# EasyEDA Pro project PWMFanController.epro

# Schematic Schematic1
Board Name: Board1; Create Date: 2026-01-06; Page Name: P1; Project Name: PWMFanController; Schematic Name: Schematic1; Update Date: 2026-07-08; Company: EasyEDA.com; Page Size: A4; Version: V1.0
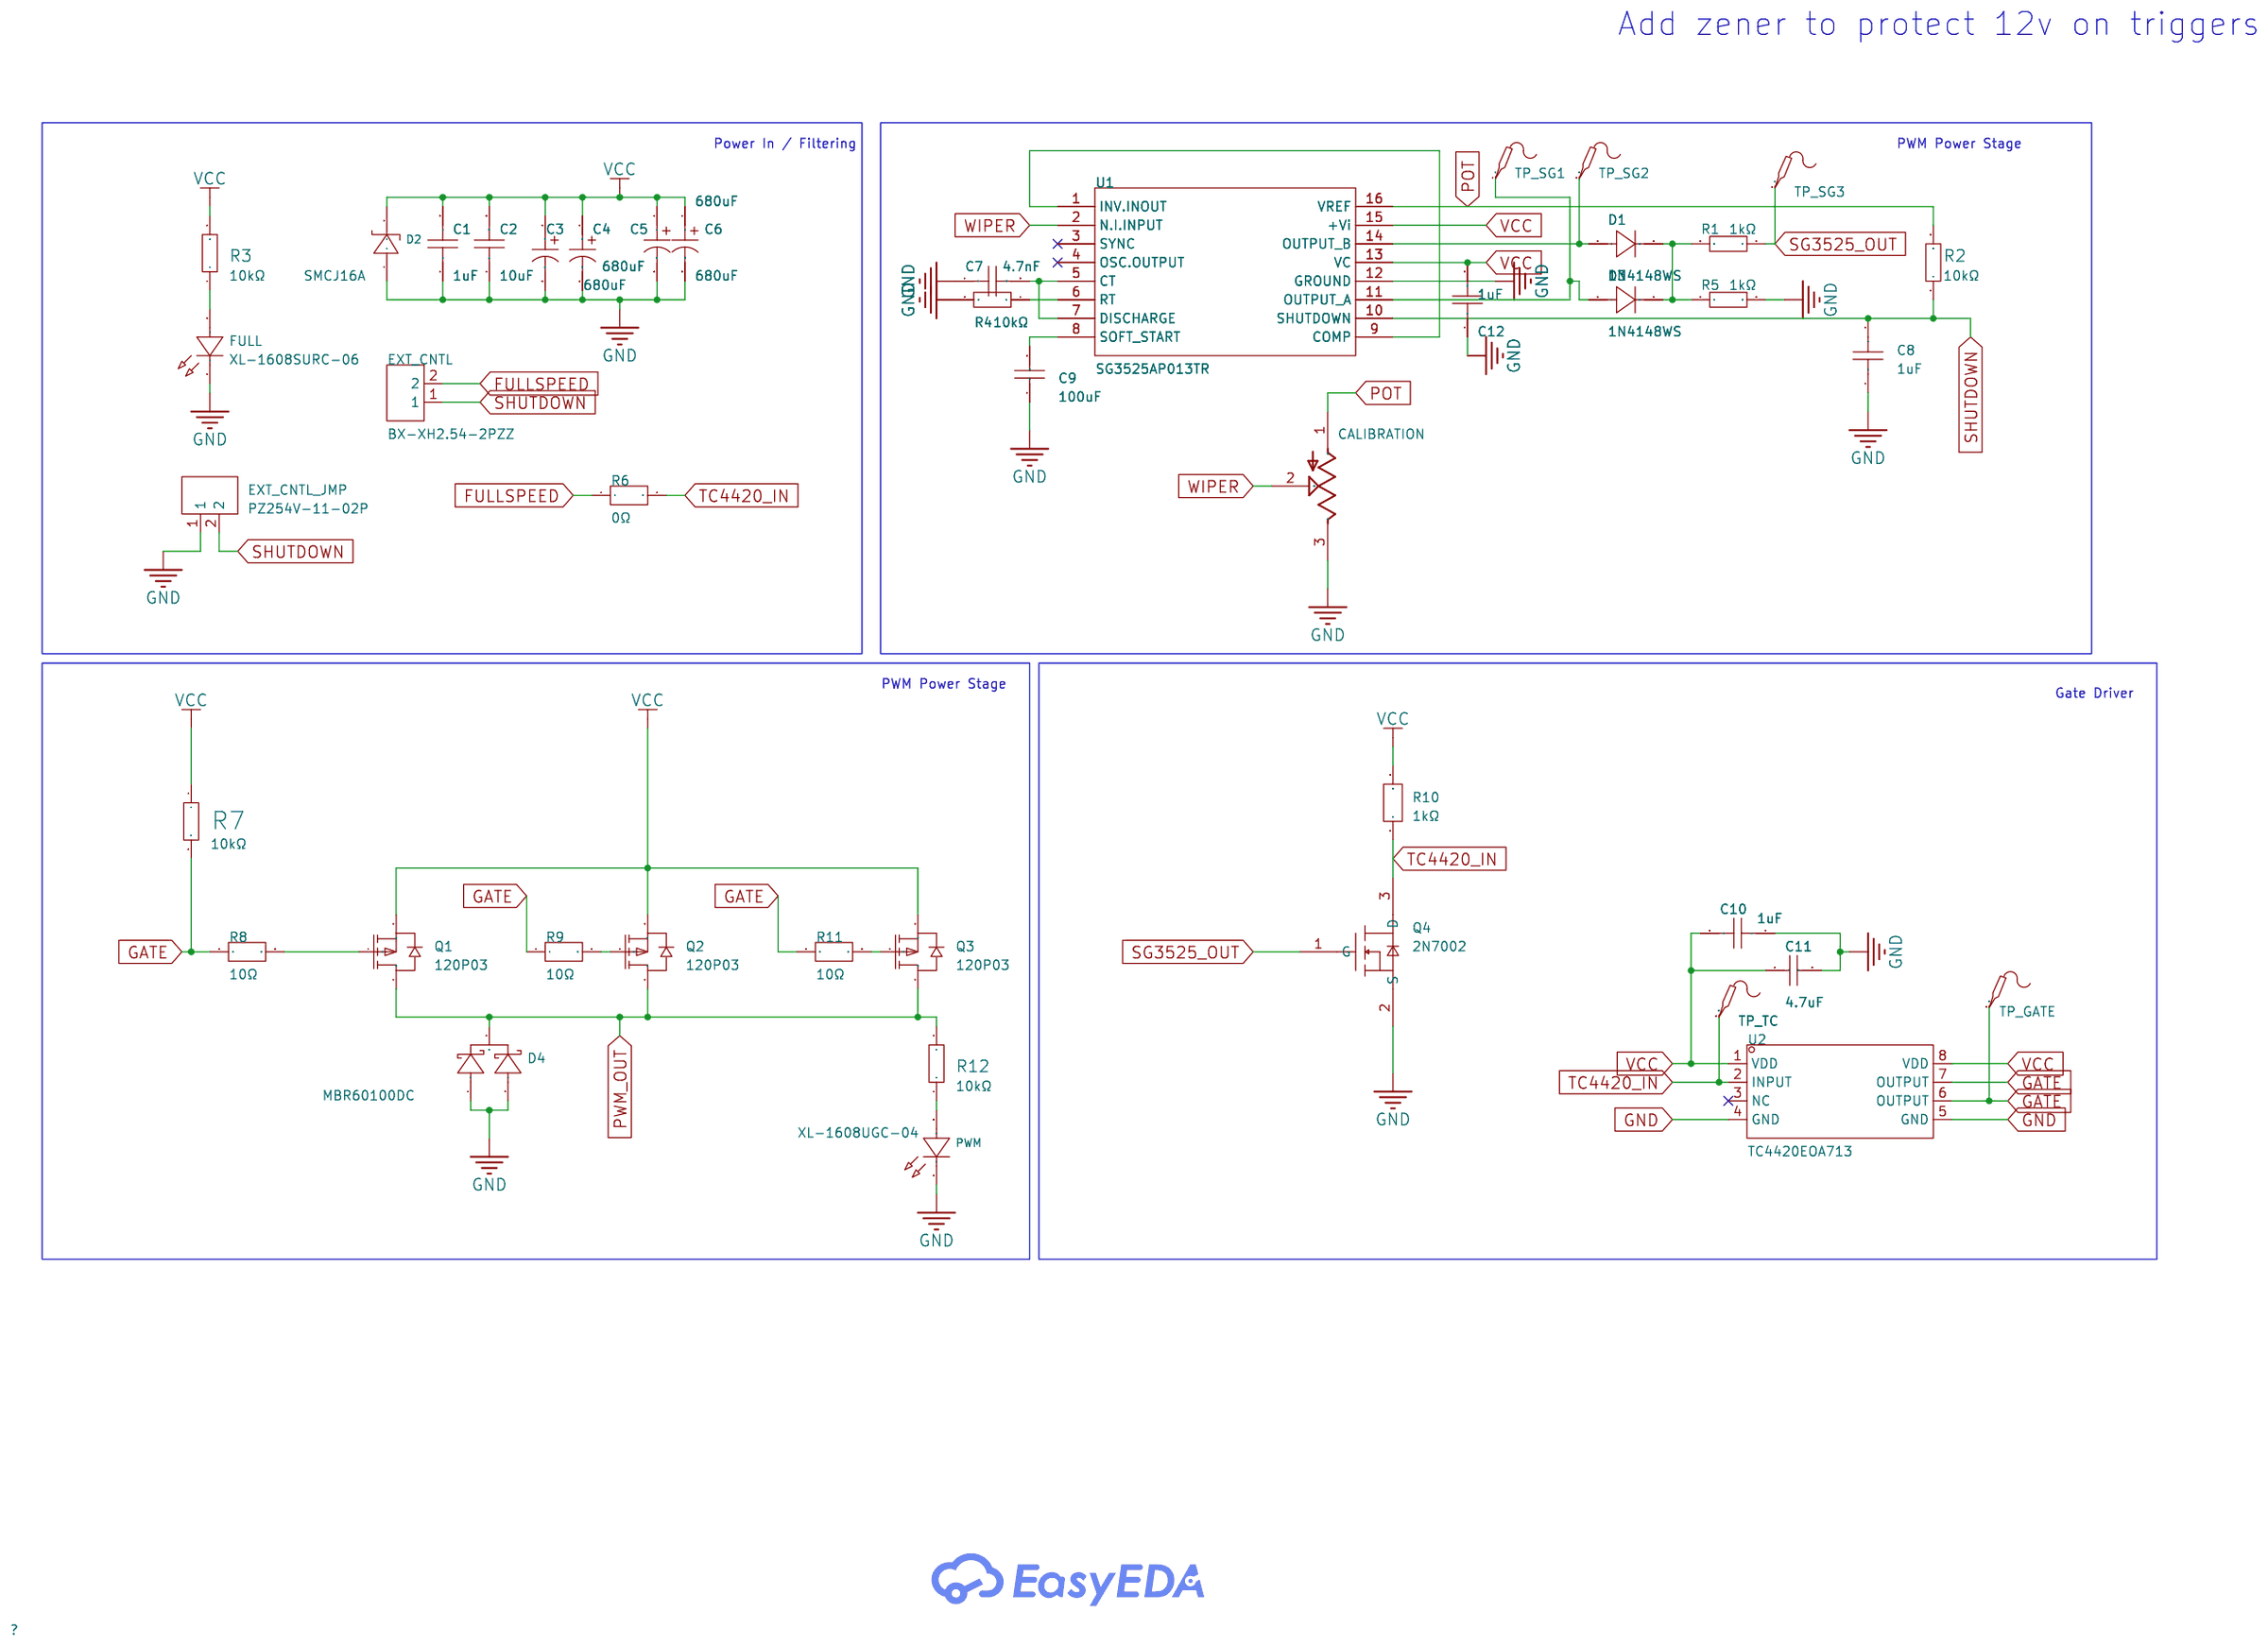
[diagram p0: schematic sheet]

## Parts
C1  1uF  [C0805]
C2  10uF  [C0805]
C3  680uF  [CAP-SMD_BD10.0-L10.3-W10.3-FD-LS11.0_H12.0]
C4  680uF  [CAP-SMD_BD10.0-L10.3-W10.3-FD-LS11.0_H12.0]
C5  680uF  [CAP-SMD_BD10.0-L10.3-W10.3-FD-LS11.0_H12.0]
C6  680uF  [CAP-SMD_BD10.0-L10.3-W10.3-FD-LS11.0_H12.0]
C7  4.7nF  [C0603]
C8  1uF  [C0603]
C9  100uF  [C1206]
C10  1uF  [C0603]
C11  4.7uF  [C0603]
C12  1uF  [C0603]
CALIBRATION  10kΩ  [RES-ADJ-TH_3362P]
D1  1N4148WS  [SOD-323_L1.8-W1.3-LS2.5-RD]
D2  SMCJ16A  [SMC_L7.1-W6.2-LS8.1-R-RD]
D3  1N4148WS  [SOD-323_L1.8-W1.3-LS2.5-RD]
D4  MBR60100DC  [TO-263-3_L10.2-W9.0-P5.08-LS15.2-BR]
EXT_CNTL  BX-XH2.54-2PZZ  [CONN-TH_2P-P2.50_BX-XH2.54-2PZZ]
EXT_CNTL_JMP  PZ254V-11-02P  [HDR-TH_2P-P2.54-V-M]
FULL  XL-1608SURC-06  [LED0603-RD_RED]
PWM  XL-1608UGC-04  [LED0603-RD_GREEN]
Q1  120P03  [TO-252-2_L6.6-W6.1-P4.57-LS9.9-BR-CW]
Q2  120P03  [TO-252-2_L6.6-W6.1-P4.57-LS9.9-BR-CW]
Q3  120P03  [TO-252-2_L6.6-W6.1-P4.57-LS9.9-BR-CW]
Q4  2N7002  [SOT-23-3_L2.9-W1.3-P1.90-LS2.4-BR]
R1  1kΩ  [R0603]
R2  10kΩ  [R0603]
R3  10kΩ  [R0603]
R4  10kΩ  [R0603]
R5  1kΩ  [R0603]
R6  0Ω  [R1210]
R7  10kΩ  [R0603]
R8  10Ω  [R0805]
R9  10Ω  [R0805]
R10  1kΩ  [R1210]
R11  10Ω  [R0805]
R12  10kΩ  [R0603]
TP_GATE  -  [Test-Point-0.5mm]
TP_SG1  -  [Test-Point-0.5mm]
TP_SG2  -  [Test-Point-0.5mm]
TP_SG3  -  [Test-Point-0.5mm]
TP_TC  -  [Test-Point-0.5mm]
U1  SG3525AP013TR  [SOIC-16_L9.9-W3.9-P1.27-LS6.0-BL]
U2  TC4420EOA713  [SOIC-8_L5.0-W4.0-P1.27-LS6.0-BL]

## Library data of the parts
C1 = GCM21BR7YA105KA55L: Capacitance: Tolerance:±10% Tolerance:±10% Voltage Rated: Temperature Coefficient:; LCSC Part Name: 1uF ±10% 35V; Supplier Part: C161268; Manufacturer: muRata(村田); Supplier Footprint: 0805; JLCPCB Part Class: Extended Part; Datasheet: https://atta.szlcsc.com/upload/public/pdf/source/20180821/C161268_D058CC9A7C4743C3F9DA2C30E4C6C8F3.pdf; Supplier: LCSC; Tolerance: ±10%
C2 = GRM21BC8YA106KE11L: Capacitance: Tolerance:±10% Tolerance:±10% Voltage Rated: Temperature Coefficient:; LCSC Part Name: 10uF ±10% 35V; Supplier Part: C469541; Manufacturer: muRata(村田); Supplier Footprint: 0805; JLCPCB Part Class: Extended Part; Datasheet: https://atta.szlcsc.com/upload/public/pdf/source/20191220/C469541_B6897061B33E942F3C678D5E9B5F39EC.pdf; Supplier: LCSC; Tolerance: ±10%
C3-C6 = MA35V680M10X13: Capacitance:680uF Tolerance:±20% Tolerance:±20% Voltage Rating:35V Ripple Current:3.9A@100kHz Equivalent Series Resistance(ESR):18mΩ@100kHz Type:Polymer Diameter:10mm Height - Seated (Max):13.5mm Lifetime:2000hrs@105℃ Operating Temperature:-55℃~+105℃ Oper; LCSC Part Name: 680uF ±20% 35V; Supplier Part: C48971043; Manufacturer: JIERR(捷而瑞); Supplier Footprint: SMD,D10xL13.5mm; JLCPCB Part Class: Extended Part; Datasheet: https://item.szlcsc.com/datasheet/MA35V680M10X13/51296248.html; Supplier: LCSC; Tolerance: ±20%; Voltage Rating: 35V; Ripple Current: 3.9A@100kHz; Equivalent Series Resistance(ESR): 18mΩ@100kHz; Type: Polymer; Diameter: 10mm; Height - Seated (Max): 13.5mm; Lifetime: 2000hrs@105℃; Operating Temperature: -55℃~+105℃
C7 = CC0603JRNPO9BN472: Capacitance: Tolerance:±5% Tolerance:±5% Voltage Rated: Temperature Coefficient:; LCSC Part Name: 4.7nF ±5% 50V; Supplier Part: C576818; Manufacturer: YAGEO(国巨); Supplier Footprint: 0603; JLCPCB Part Class: Extended Part; Datasheet: https://atta.szlcsc.com/upload/public/pdf/source/20200423/C519397_5D7358A8DEECBF1C07A68D711E115506.pdf; Supplier: LCSC; Tolerance: ±5%
C8 C12 = HGC0603R7105K250NTHJ: Capacitance:1uF Tolerance:±10% Tolerance:±10% Voltage Rating:25V Temperature Coefficient:X7R; LCSC Part Name: 1uF ±10% 25V; Supplier Part: C33546005; Manufacturer: Chinocera(华瓷); Supplier Footprint: 0603; JLCPCB Part Class: Extended Part; Datasheet: https://item.szlcsc.com/datasheet/HGC0603R7105K250NTHJ/35278483.html; Supplier: LCSC; Tolerance: ±10%; Voltage Rating: 25V; Temperature Coefficient: X7R
C9 = CL31A107MQHNNNE: Capacitance:100uF Tolerance:±20% Tolerance:±20% Voltage Rating:6.3V Temperature Coefficient:X5R; LCSC Part Name: 100uF ±20% 6.3V; Supplier Part: C15008; Manufacturer: SAMSUNG(三星); Supplier Footprint: 1206; JLCPCB Part Class: Basic Part; Datasheet: https://item.szlcsc.com/datasheet/CL31A107MQHNNNE/15681.html; Supplier: LCSC; Tolerance: ±20%; Voltage Rating: 6.3V; Temperature Coefficient: X5R
C10 = CGA3E1X7R1V105KT000N: Capacitance:1uF Tolerance:±10% Tolerance:±10% Voltage Rating:35V Temperature Coefficient:X7R; LCSC Part Name: 1uF ±10% 35V; Supplier Part: C342956; Manufacturer: TDK; Supplier Footprint: 0603; JLCPCB Part Class: Extended Part; Datasheet: https://item.szlcsc.com/datasheet/CGA3E1X7R1V105KT000N/319806.html; Supplier: LCSC; Tolerance: ±10%; Voltage Rating: 35V; Temperature Coefficient: X7R
C11 = EMK107ABJ475KA-T: Capacitance:4.7uF Tolerance:±10% Tolerance:±10% Voltage Rating:16V Temperature Coefficient:X5R; LCSC Part Name: MSASE168AB5475KTNA01 4.7uF ±10% 16V; Supplier Part: C92758; Manufacturer: TAIYO YUDEN(太诱); Supplier Footprint: 0603; JLCPCB Part Class: Extended Part; Datasheet: https://item.szlcsc.com/datasheet/EMK107ABJ475KA-T/93952.html; Supplier: LCSC; Tolerance: ±10%; Voltage Rating: 16V; Temperature Coefficient: X5R
CALIBRATION = 3362P-1-103_C118956: Resistance: Tolerance:±10% Tolerance:±10%; LCSC Part Name: 10kΩ ±10%; Supplier Part: C118956; Manufacturer: BOCHEN(博晨); Manufacturer Part: 3362P-1-103; Supplier Footprint: 插件; JLCPCB Part Class: Extended Part; Datasheet: https://atta.szlcsc.com/upload/public/pdf/source/20171114/C118956_15106326650691117445.pdf; Supplier: LCSC; Tolerance: ±10%; Check: true
D1 D3 = 1N4148WS_C917117: Diode Configuration:Independent Voltage - Forward(Vf@If):1.25V@150mA Voltage - DC Reverse(Vr):75V Current - Rectified:200mA Pd - Power Dissipation:200mW Reverse Leakage Current (Ir):1uA@75V Reverse Recovery Time (trr):4ns Operating Junction Temperature Ra; LCSC Part Name: 75V 200mA; Supplier Part: C917117; Manufacturer: JSMSEMI(杰盛微); Supplier Footprint: SOD-323; JLCPCB Part Class: Extended Part; Datasheet: https://item.szlcsc.com/datasheet/1N4148WS/991613.html; Supplier: LCSC; Diode Configuration: Independent; Voltage - Forward(Vf@If): 1.25V@150mA; Voltage - DC Reverse(Vr): 75V; Current - Rectified: 200mA; Pd - Power Dissipation: 200mW; Reverse Leakage Current (Ir): 1uA@75V; Reverse Recovery Time (trr): 4ns; Operating Junction Temperature Range: -55℃~+150℃@(Tj); Non-Repetitive Peak Forward Surge Current: 2A
D2 = SMCJ16A_C10249: Reverse Stand-Off Voltage (Vrwm):16V Clamping Voltage:26V Peak Pulse Current (Ipp):57.7A Voltage - Breakdown:17.8V Type:TVS; Supplier Part: C10249; Manufacturer: RUILON(瑞隆源); Supplier Footprint: SMC(DO-214AB); JLCPCB Part Class: Extended Part; Datasheet: https://item.szlcsc.com/datasheet/SMCJ16A/10791.html; Supplier: LCSC; Reverse Stand-Off Voltage (Vrwm): 16V; Clamping Voltage: 26V; Peak Pulse Current (Ipp): 57.7A; Voltage - Breakdown: 17.8V; Type: TVS
D4 = MBR60100DC: Voltage - Forward(Vf@If):840mV@30A Voltage - DC Reverse(Vr):100V Current - Rectified:60A Reverse Leakage Current (Ir):3mA@100V Non-Repetitive Peak Forward Surge Current:450A; LCSC Part Name: 电压:100V 电流:60A; Supplier Part: C6069541; Manufacturer: YFW(佑风微); Supplier Footprint: TO-263; JLCPCB Part Class: Extended Part; Datasheet: https://item.szlcsc.com/datasheet/MBR60100DC/7009147.html; Supplier: LCSC; Voltage - Forward(Vf@If): 840mV@30A; Voltage - DC Reverse(Vr): 100V; Current - Rectified: 60A; Reverse Leakage Current (Ir): 3mA@100V; Non-Repetitive Peak Forward Surge Current: 450A
EXT_CNTL = BX-XH2.54-2PZZ: Pins Structure:1x2P Pitch:2.5mm Mounting Type:Through Hole Reference Series:XH Number of Pins:2P Number of Rows:1 Number of PINs Per Row:2 Row Spacing:- Current Rating:3A Contact Material:Brass Contact Plating:Tin Operating Temperature:-25℃~+85℃ Operating; LCSC Part Name: 1x2P 间距:2.5mm 直插 系列:XH; Supplier Part: C18077833; Manufacturer: Bossie(博锡); Supplier Footprint: 插件,P=2.54mm; JLCPCB Part Class: Extended Part; Datasheet: https://item.szlcsc.com/datasheet/BX-XH2.54-2PZZ/19218234.html; Supplier: LCSC; Pins Structure: 1x2P; Pitch: 2.5mm; Mounting Type: Through Hole; Reference Series: XH; Number of Pins: 2P; Number of Rows: 1; Number of PINs Per Row: 2; Current Rating: 3A; Contact Material: Brass; Contact Plating: Tin; Operating Temperature: -25℃~+85℃; Voltage Rating: 250V; Plastic Material: PA66; Flame Retardant Rating: UL94V-0; Color: White; Z-Height of the Board: 7mm; X-Length of Bottom Edge on Board (Spacing Line): 7.5mm; Y-Width of Bottom Edge on Board: 5.9mm
EXT_CNTL_JMP = PZ254V-11-02P: Pin Structure:1x2P Pitch:2.54mm Row Spacing:- Circluar Pins/Square Pins:Pin Header Mounting Type:Through Hole Number of Rows:1 Number of Pins:2P Current Rating:- Voltage Rating (Max):- Length of Mating Pin:6mm Insulation Height:2.5mm Length of End Connect; LCSC Part Name: 1x2P 间距:2.54mm 方针 直插; Supplier Part: C492401; Manufacturer: XFCN(兴飞); Supplier Footprint: 插件,P=2.54mm; JLCPCB Part Class: Extended Part; Datasheet: https://item.szlcsc.com/datasheet/PZ254V-11-02P/502957.html; Supplier: LCSC; Pin Structure: 1x2P; Pitch: 2.54mm; Circluar Pins/Square Pins: Pin Header; Mounting Type: Through Hole; Number of Rows: 1; Number of Pins: 2P; Length of Mating Pin: 6mm; Insulation Height: 2.5mm; Length of End Connection Pin: 3mm; Contact Material: Brass; Operating Temperature: -40℃~+105℃; Color: Black
FULL = XL-1608SURC-06: Lamp Holder Type:1.6mm x 0.8mm square LED Illumination Color:Red Voltage - Forward(Vf):2.3V Voltage - Forward(Vf):2.3V Power(Watts):50mW Forward Current:20mA Wavelength - Dominant:620nm~630nm Wavelength - Dominant:620nm~630nm Peak Wavelength:625nm Peak Wa; LCSC Part Name: 0603红色贴片式发光二极管; Supplier Part: C965799; Manufacturer: XINGLIGHT(成兴光); Supplier Footprint: 0603; JLCPCB Part Class: Extended Part; Datasheet: https://item.szlcsc.com/datasheet/XL-1608SURC-06/1051408.html; Supplier: LCSC; Lamp Holder Type: 1.6mm x 0.8mm square LED; Illumination Color: Red; Voltage - Forward(Vf): 2.3V; Power(Watts): 50mW; Forward Current: 20mA; Wavelength - Dominant: 620nm~630nm; Peak Wavelength: 625nm; Diode Configuration: Discrete Diode; Lens Color: Water Clear; Luminous Intensity: 225mcd; Viewing Angle: 120°; Mounting Style: Top-mount; Operating Temperature: -40℃~+85℃
PWM = XL-1608UGC-04: Lamp Holder Type:- Illumination Color:Emerald Green Voltage - Forward(Vf):3.3V Voltage - Forward(Vf):3.3V Power(Watts):70mW Forward Current:20mA Wavelength - Dominant:515nm~535nm Wavelength - Dominant:515nm~535nm Peak Wavelength:525nm Diode Configuration:; LCSC Part Name: 0603翠绿贴片式发光二极管; Supplier Part: C965804; Manufacturer: XINGLIGHT(成兴光); Supplier Footprint: 0603; JLCPCB Part Class: Extended Part; Datasheet: https://item.szlcsc.com/datasheet/XL-1608UGC-04/1051413.html; Supplier: LCSC; Illumination Color: Emerald Green; Voltage - Forward(Vf): 3.3V; Power(Watts): 70mW; Forward Current: 20mA; Wavelength - Dominant: 515nm~535nm; Peak Wavelength: 525nm; Diode Configuration: Discrete Diode; Lens Color: Water Clear; Luminous Intensity: 810mcd; Viewing Angle: 120°; Mounting Style: Top-mount; Operating Temperature: -40℃~+85℃
Q1-Q3 = 120P03: Number:1 P-Channel Drain to Source Voltage:30V Current - Continuous Drain(Id):120A RDS(on):3.1mΩ@10V Pd - Power Dissipation:100W Gate Threshold Voltage (Vgs(th)):2.5V Gate Charge(Qg):130nC@10V Input Capacitance(Ciss):7nF Reverse Transfer Capacitance (Crss; LCSC Part Name: 1个P沟道 耐压:30V 电流:120A; Supplier Part: C20071222; Manufacturer: HL(富海微); Supplier Footprint: TO-252; JLCPCB Part Class: Extended Part; Datasheet: https://item.szlcsc.com/datasheet/120P03/21399621.html; Supplier: LCSC; Number: 1 P-Channel; Drain to Source Voltage: 30V; Current - Continuous Drain(Id): 120A; RDS(on): 3.1mΩ@10V; Pd - Power Dissipation: 100W; Gate Threshold Voltage (Vgs(th)): 2.5V; Gate Charge(Qg): 130nC@10V; Input Capacitance(Ciss): 7nF; Reverse Transfer Capacitance (Crss@Vds): 540pF; Operating Temperature: -55℃~+175℃; Type: P-Channel; Output Capacitance(Coss): 820pF
Q4 = 2N7002_C916396: Number:1 N-channel Drain to Source Voltage:60V Current - Continuous Drain(Id):115mA RDS(on):1.7Ω@5V Pd - Power Dissipation:200mW Gate Threshold Voltage (Vgs(th)):2.5V Gate Charge(Qg):- Input Capacitance(Ciss):50pF Reverse Transfer Capacitance (Crss@Vds):5; LCSC Part Name: 1个N沟道 耐压:60V 电流:115mA; Supplier Part: C916396; Manufacturer: JSMSEMI(杰盛微); Supplier Footprint: SOT-23; JLCPCB Part Class: Extended Part; Datasheet: https://item.szlcsc.com/datasheet/2N7002/990892.html; Supplier: LCSC; Number: 1 N-channel; Drain to Source Voltage: 60V; Current - Continuous Drain(Id): 115mA; RDS(on): 1.7Ω@5V; Pd - Power Dissipation: 200mW; Gate Threshold Voltage (Vgs(th)): 2.5V; Input Capacitance(Ciss): 50pF; Reverse Transfer Capacitance (Crss@Vds): 5pF; Operating Temperature: -55℃~+150℃
R1 R5 = 0603WAF1001T5E: Type:Thick Film Resistor Resistance:1kΩ Tolerance:±1% Tolerance:±1% Power(Watts):100mW Voltage-Supply(Max):75V Temperature Coefficient:±100ppm/℃ Temperature Coefficient:±100ppm/℃ Operating Temperature:-55℃~+155℃ Operating Temperature:-55℃~+155℃; LCSC Part Name: 1kΩ ±1% 100mW 厚膜电阻; Supplier Part: C21190; Manufacturer: UNI-ROYAL(厚声); Supplier Footprint: 0603; JLCPCB Part Class: Basic Part; Datasheet: https://item.szlcsc.com/datasheet/0603WAF1001T5E/21904.html; Supplier: LCSC; Type: Thick Film Resistor; Tolerance: ±1%; Power(Watts): 100mW; Voltage-Supply(Max): 75V; Temperature Coefficient: ±100ppm/℃; Operating Temperature: -55℃~+155℃
R2-R4 R7 R12 = 0603WAF1002T5E: Type:Thick Film Resistor Resistance:10kΩ Tolerance:±1% Tolerance:±1% Power(Watts):100mW Voltage-Supply(Max):75V Temperature Coefficient:±100ppm/℃ Temperature Coefficient:±100ppm/℃ Operating Temperature:-55℃~+155℃ Operating Temperature:-55℃~+155℃; LCSC Part Name: 厚膜电阻 10kΩ ±1% 100mW; Supplier Part: C25804; Manufacturer: UNI-ROYAL(厚声); Supplier Footprint: 0603; JLCPCB Part Class: Basic Part; Datasheet: https://item.szlcsc.com/datasheet/0603WAF1002T5E/26547.html; Supplier: LCSC; Type: Thick Film Resistor; Tolerance: ±1%; Power(Watts): 100mW; Voltage-Supply(Max): 75V; Temperature Coefficient: ±100ppm/℃; Operating Temperature: -55℃~+155℃
R6 = FRC1210F0000TS: Type:Thick Film Resistor Resistance:0Ω Tolerance:±1% Tolerance:±1% Power(Watts):500mW Voltage-Supply(Max):200V Temperature Coefficient:±200ppm/℃ Temperature Coefficient:±200ppm/℃ Operating Temperature:-55℃~+155℃ Operating Temperature:-55℃~+155℃; LCSC Part Name: 厚膜电阻 0Ω ±1% 500mW; Supplier Part: C2974058; Manufacturer: FOJAN(富捷); Supplier Footprint: 1210; JLCPCB Part Class: Extended Part; Datasheet: https://item.szlcsc.com/datasheet/FRC1210F0000TS/3373685.html; Supplier: LCSC; Type: Thick Film Resistor; Tolerance: ±1%; Power(Watts): 500mW; Voltage-Supply(Max): 200V; Temperature Coefficient: ±200ppm/℃; Operating Temperature: -55℃~+155℃
R8 R9 R11 = AS05W2J0100T5E_C966152: Type:Thick Film Resistor Resistance:10Ω Tolerance:±5% Tolerance:±5% Power(Watts):500mW Voltage-Supply(Max):150V Temperature Coefficient:±400ppm/℃ Temperature Coefficient:±400ppm/℃ Operating Temperature:-55℃~+155℃ Operating Temperature:-55℃~+155℃; LCSC Part Name: 10Ω ±5% 500mW 厚膜电阻 抗浪涌厚膜晶片电阻器; Supplier Part: C966152; Manufacturer: UNI-ROYAL(厚声); Manufacturer Part: AS05W2J0100T5E; Supplier Footprint: 0805; JLCPCB Part Class: Extended Part; Datasheet: https://item.szlcsc.com/datasheet/AS05W2J0100T5E/1052020.html; Supplier: LCSC; Type: Thick Film Resistor; Tolerance: ±5%; Power(Watts): 500mW; Voltage-Supply(Max): 150V; Temperature Coefficient: ±400ppm/℃; Operating Temperature: -55℃~+155℃
R10 = FRC1210J102TS: Type:Thick Film Resistor Resistance:1kΩ Tolerance:±5% Tolerance:±5% Power(Watts):500mW Voltage-Supply(Max):200V Temperature Coefficient:±100ppm/℃ Temperature Coefficient:±100ppm/℃ Operating Temperature:-55℃~+155℃ Operating Temperature:-55℃~+155℃; LCSC Part Name: 厚膜电阻 1kΩ ±5% 500mW; Supplier Part: C2930439; Manufacturer: FOJAN(富捷); Supplier Footprint: 1210; JLCPCB Part Class: Extended Part; Datasheet: https://item.szlcsc.com/datasheet/FRC1210J102TS/3267372.html; Supplier: LCSC; Type: Thick Film Resistor; Tolerance: ±5%; Power(Watts): 500mW; Voltage-Supply(Max): 200V; Temperature Coefficient: ±100ppm/℃; Operating Temperature: -55℃~+155℃
TP_GATE TP_SG1-TP_SG3 TP_TC = Test-Point: Test Point 测试点
U1 = SG3525AP013TR: Isolation:Non-Isolated Voltage - Supply:8V~35V Voltage - Supply:8V~35V Frequency - Switching:100Hz~400kHz Frequency - Switching:100Hz~400kHz Output Current:100mA Pd - Power Dissipation:1000mW Duty Cycle(Max):49% Voltage - Breakdown:- Topology:Totem pole F; LCSC Part Name: 8V~35V; Supplier Part: C68323; Manufacturer: ST(意法半导体); Supplier Footprint: SOIC-16; JLCPCB Part Class: Extended Part; Datasheet: https://item.szlcsc.com/datasheet/SG3525AP013TR/69429.html; Supplier: LCSC; Isolation: Non-Isolated; Voltage - Supply: 8V~35V; Frequency - Switching: 100Hz~400kHz; Output Current: 100mA; Pd - Power Dissipation: 1000mW; Duty Cycle(Max): 49%; Topology: Totem pole; Features: Under-voltage lockout；Adjustable soft-start；Under Voltage Protection; Operating Temperature: 0℃~+70℃; Working Mode: PWM Modulation
U2 = TC4420EOA713: Driven Configuration:- Load Type:MOSFET Number of Drivers:1 Current - Output Low(IOL):6A Current - Output High(IOH):6A Voltage - Supply:4.5V~18V Voltage - Supply:4.5V~18V Rise Time:25ns Fall Time:25ns Features:- Operating Temperature:-40℃~+150℃@(Tj) Opera; LCSC Part Name: 6A高速MOSFET驱动器; Supplier Part: C231865; Manufacturer: MICROCHIP(美国微芯); Supplier Footprint: SOIC-8; JLCPCB Part Class: Extended Part; Datasheet: https://item.szlcsc.com/datasheet/TC4420EOA713/231748.html; Supplier: LCSC; Load Type: MOSFET; Number of Drivers: 1; Current - Output Low(IOL): 6A; Current - Output High(IOH): 6A; Voltage - Supply: 4.5V~18V; Rise Time: 25ns; Fall Time: 25ns; Operating Temperature: -40℃~+150℃@(Tj); Quiescent Current(Iq): 450uA

## Nets
GND: C1.1 C2.1 C3.2 C4.2 C5.2 C6.2 C7.1 C8.1 C9.1 C10.1 C11.2 C12.1 CALIBRATION.3(CW) D2.1(A) D4.1(A) D4.3(A) EXT_CNTL_JMP.1 FULL.1(K) PWM.1(K) Q4.2(S) R4.2 R5.2 U1.12(GROUND) U2.4(GND) U2.5(GND)
VCC: C1.2 C2.2 C3.1 C4.1 C5.1 C6.1 C10.2 C11.1 C12.2 D2.2(K) Q1.3(S) Q2.3(S) Q3.3(S) R3.2 R7.1 R10.2 U1.13(VC) U1.15(+Vi) U2.1(VDD) U2.8(VDD)
FULLSPEED: EXT_CNTL.2 R6.1
GATE: R7.2 R8.1 R9.1 R11.1 TP_GATE.1 U2.6(OUTPUT) U2.7(OUTPUT)
POT: CALIBRATION.1(CCW) R2.2 U1.16(VREF)
PWM_OUT: D4.2(C) Q1.2(D) Q2.2(D) Q3.2(D) R12.2
SG3525_OUT: Q4.1(G) R1.1 TP_SG3.1
SHUTDOWN: C8.2 EXT_CNTL.1 EXT_CNTL_JMP.2 R2.1 U1.10(SHUTDOWN)
TC4420_IN: Q4.3(D) R6.2 R10.1 TP_TC.1 U2.2(INPUT)
WIPER: CALIBRATION.2(WIPER) U1.2(N.I.INPUT)
Net-(C7-2): C7.2 U1.5(CT) U1.7(DISCHARGE)
Net-(C9-2): C9.2 U1.8(SOFT_START)
Net-(D1-1): D1.1(C) D3.1(C) R1.2 R5.1
Net-(D1-2): D1.2(A) TP_SG2.1 U1.14(OUTPUT B)
Net-(D3-2): D3.2(A) TP_SG1.1 U1.11(OUTPUT A)
Net-(FULL-2): FULL.2(A) R3.1
Net-(PWM-2): PWM.2(A) R12.1
Net-(Q1-1): Q1.1(G) R8.2
Net-(Q2-1): Q2.1(G) R9.2
Net-(Q3-1): Q3.1(G) R11.2
Net-(R4-1): R4.1 U1.6(RT)
Net-(U1-1): U1.1(INV.INOUT) U1.9(COMP)

Not connected (* = marked no-connect by the designer): U1 3(SYNC)* 4(OSC.OUTPUT)*; U2 3(NC)*

## Notes on the sheet
- Add zener to protect 12v on triggers
- Power In / Filtering
- PWM Power Stage
- PWM Power Stage
- Gate Driver
